# EAGLE schematic KKK_valdiklis (EAGLE 6.4)
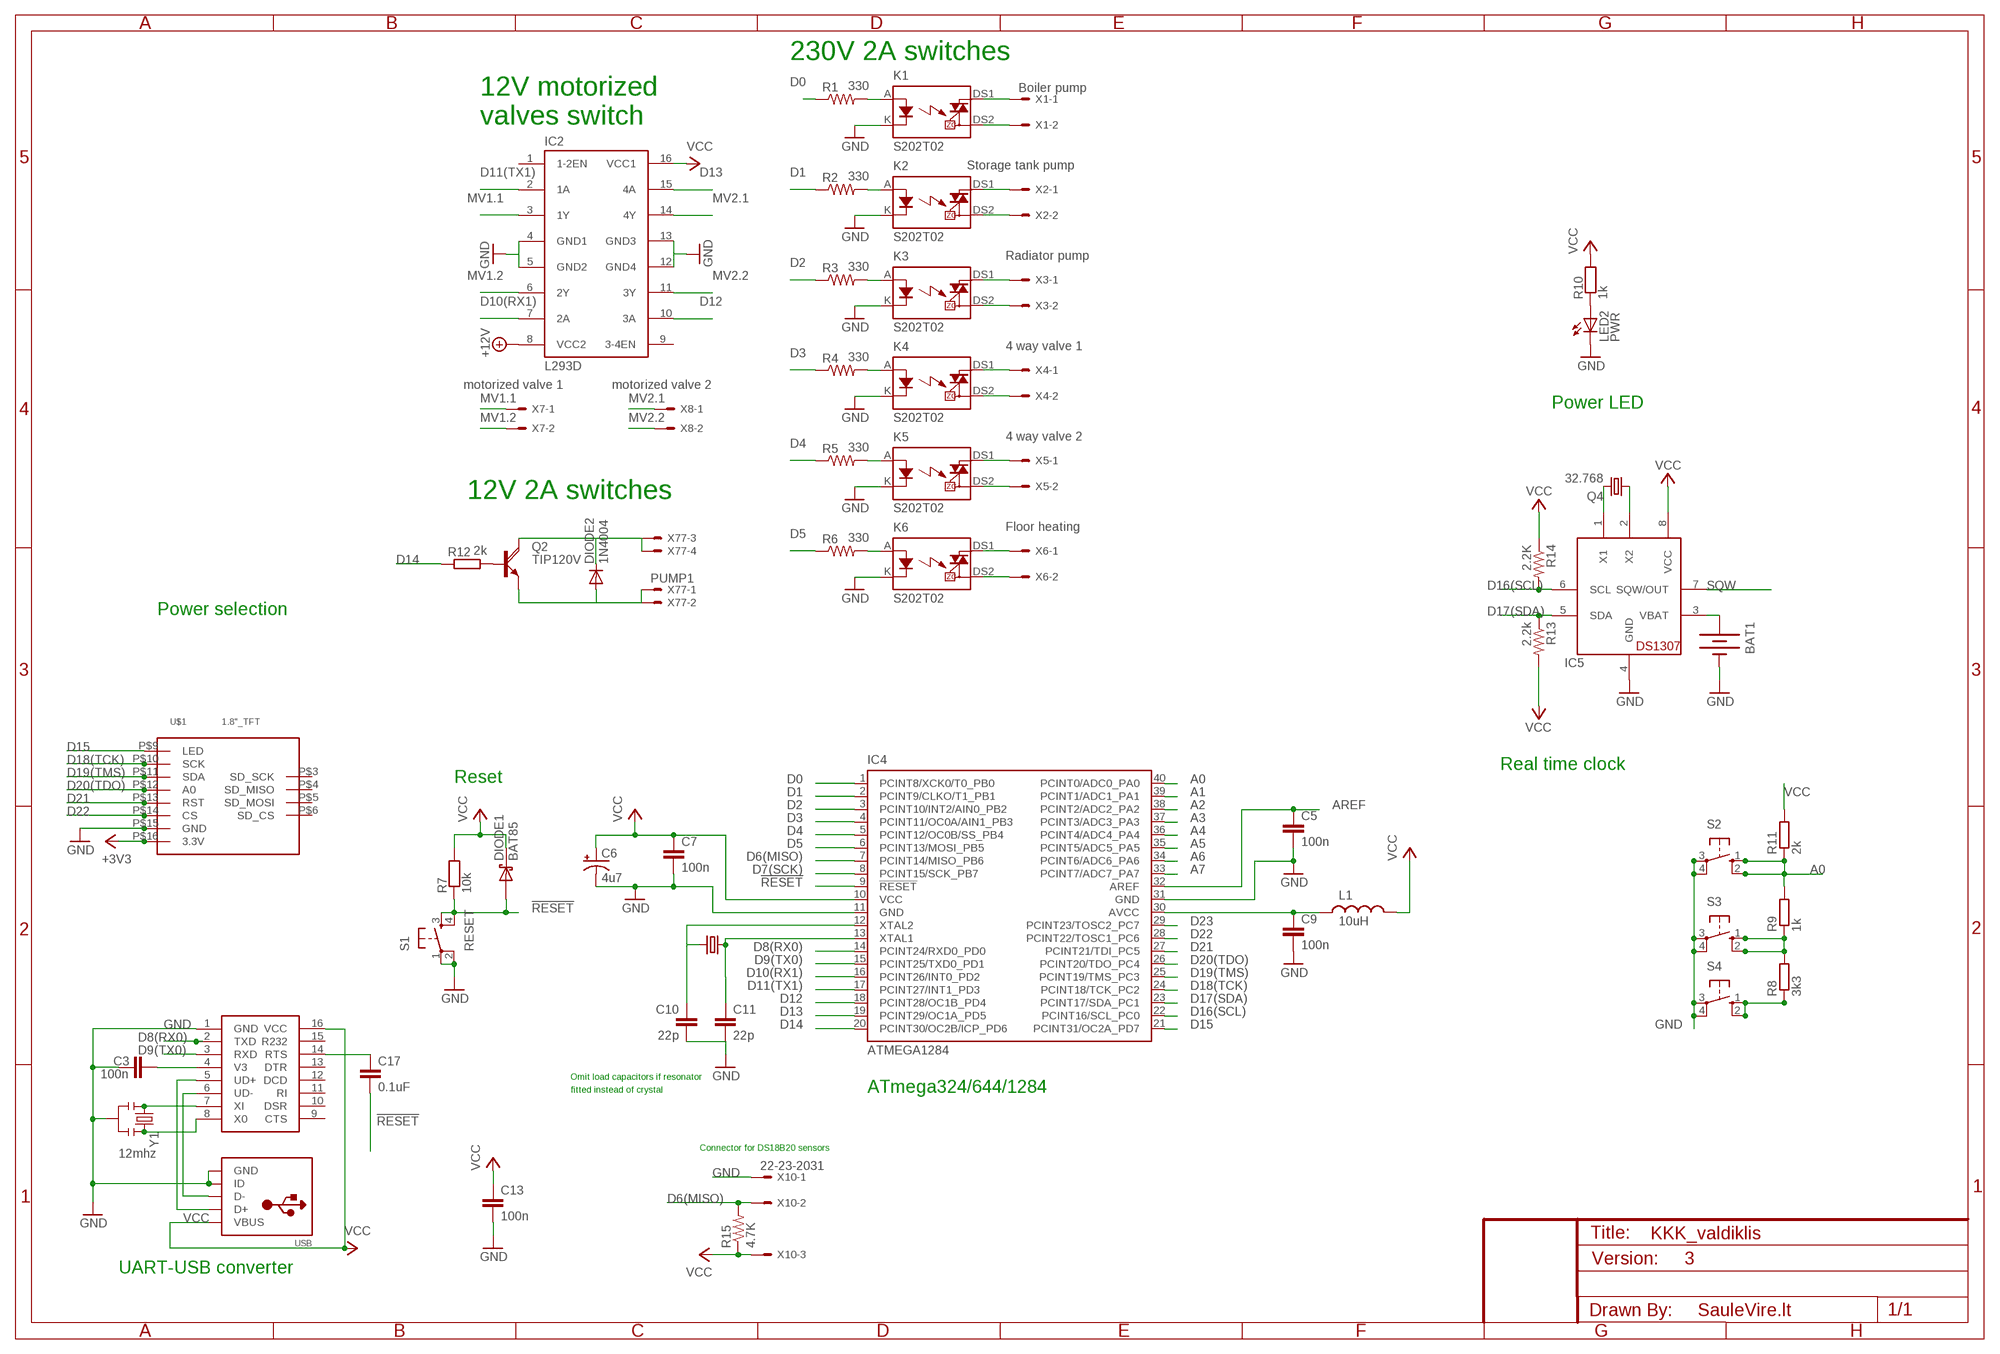
[diagram p0: schematic, sheet 1]

## Parts
BAT1  BATTERY20PTH  [BATTCOM_20MM_PTH]
C3  100n  CAPPTH  [CAP-PTH-SMALL]
C5  100n  CAPPTH  [CAP-PTH-SMALL]
C6  4u7  CAP_POLPTH2  [CPOL-RADIAL-10UF-25V]
C7  100n  CAPPTH  [CAP-PTH-SMALL]
C9  100n  CAPPTH  [CAP-PTH-SMALL]
C10  22p  CAPPTH  [CAP-PTH-SMALL]
C11  22p  CAPPTH  [CAP-PTH-SMALL]
C13  100n  CAPPTH  [CAP-PTH-SMALL]
C17  0.1uF  C-EU025-024X044  [C025-024X044]
DIODE1  BAT85  DIODE-SCHOTTKY  [DIODE-TH-0.4]
DIODE2  1N4004  [DO41-10]
IC2  L293D  [DIL16]
IC4  ATMEGA1284  ATMEGA644-20PU  [DIL40]
IC5  DS1307  [DIL08]
K1  S202T02  [S202T02]
K2  S202T02  [S202T02]
K3  S202T02  [S202T02]
K4  S202T02  [S202T02]
K5  S202T02  [S202T02]
K6  S202T02  [S202T02]
L1  10uH  INDUCTOR0.4"-AXIAL  [RES-AXIAL-0.4]
LED2  PWR  LED3MM  [LED3MM]
Q2  TIP120V  [TO220AV]
Q4  32.768  CRYTALTC38H  [TC38H]
R1  330  R-US_0207/10  [0207/10]
R2  330  R-US_0207/10  [0207/10]
R3  330  R-US_0207/10  [0207/10]
R4  330  R-US_0207/10  [0207/10]
R5  330  R-US_0207/10  [0207/10]
R6  330  R-US_0207/10  [0207/10]
R7  10k  RESISTOR  [RES-AXIAL-0.4]
R8  3k3  R-EU_0207/10  [0207/10]
R9  1k  R-EU_0207/10  [0207/10]
R10  1k  RESISTOR  [RES-AXIAL-0.4]
R11  2k  R-EU_0207/10  [0207/10]
R12  2k  R-EU_0207/10  [0207/10]
R13  2.2k  R-US_0207/10  [0207/10]
R14  2.2K  R-US_0207/10  [0207/10]
R15  4.7K  R-US_0207/10  [0207/10]
S1  RESET  TAC_SWITCHPTH  [TACTILE-PTH]
S2  10-XX  [B3F-10XX]
S3  10-XX  [B3F-10XX]
S4  10-XX  [B3F-10XX]
U$1  1.8"_TFT  [1.8"_TFT]
U$2  CH340G  [SO016]
USB  USBMOLEX  [USB-MINIB-THM-MOLEX]
X1  Boiler pump  22-23-2021  [22-23-2021]
X2  Storage tank pump  22-23-2021  [22-23-2021]
X3  Radiator pump  22-23-2021  [22-23-2021]
X4  4 way valve 1  22-23-2021  [22-23-2021]
X5  4 way valve 2  22-23-2021  [22-23-2021]
X6  Floor heating  22-23-2021  [22-23-2021]
X7  motorized valve 1  22-23-2021  [22-23-2021]
X8  motorized valve 2  22-23-2021  [22-23-2021]
X9  16MHz  CRYSTALHC49US  [HC49US]
X10  22-23-2031  [22-23-2031]
X77  PUMP1  22-23-2041  [22-23-2041]
Y1  12mhz  RESONATORPTH  [RESONATOR-PTH]

## Nets
!RESET: C17.2 DIODE1.A IC4.9(!RESET) R7.P$1 S1.3 S1.4
+3V3 [power]: U$1.P$16(3.3V)
+12V: IC2.8(VCC2)
A0: IC4.40(PCINT0/ADC0_PA0) R9.2 R11.1 S2.1(S) S2.2(S1)
A1: IC4.39(PCINT1/ADC1_PA1)
A2: IC4.38(PCINT2/ADC2_PA2)
A3: IC4.37(PCINT3/ADC3_PA3)
A4: IC4.36(PCINT4/ADC4_PA4)
A5: IC4.35(PCINT5/ADC5_PA5)
A6: IC4.34(PCINT6/ADC6_PA6)
A7: IC4.33(PCINT7/ADC7_PA7)
AREF: C5.1 IC4.32(AREF)
AVCC [power]: C9.1 IC4.30(AVCC) L1.P$1
D0: IC4.1(PCINT8/XCK0/T0_PB0) R1.1
D1: IC4.2(PCINT9/CLKO/T1_PB1) R2.1
D2: IC4.3(PCINT10/INT2/AIN0_PB2) R3.1
D3: IC4.4(PCINT11/OC0A/AIN1_PB3) R4.1
D4: IC4.5(PCINT12/OC0B/SS_PB4) R5.1
D5: IC4.6(PCINT13/MOSI_PB5) R6.1
D6(MISO): IC4.7(PCINT14/MISO_PB6) R15.2 X10.2
D7(SCK): IC4.8(PCINT15/SCK_PB7)
D8(RX0): IC4.14(PCINT24/RXD0_PD0) U$2.2(TXD)
D9(TX0): IC4.15(PCINT25/TXD0_PD1) U$2.3(RXD)
D10(RX1): IC2.7(2A) IC4.16(PCINT26/INT0_PD2)
D11(TX1): IC2.2(1A) IC4.17(PCINT27/INT1_PD3)
D12: IC2.10(3A) IC4.18(PCINT28/OC1B_PD4)
D13: IC2.15(4A) IC4.19(PCINT29/OC1A_PD5)
D14: IC4.20(PCINT30/OC2B/ICP_PD6) R12.1
D15: IC4.21(PCINT31/OC2A_PD7) U$1.P$9(LED)
D16(SCL): IC4.22(PCINT16/SCL_PC0) IC5.6(SCL) R14.2
D17(SDA): IC4.23(PCINT17/SDA_PC1) IC5.5(SDA) R13.1
D18(TCK): IC4.24(PCINT18/TCK_PC2) U$1.P$10(SCK)
D19(TMS): IC4.25(PCINT19/TMS_PC3) U$1.P$11(SDA)
D20(TDO): IC4.26(PCINT20/TDO_PC4) U$1.P$12(A0)
D21: IC4.27(PCINT21/TDI_PC5) U$1.P$13(RST)
D22: IC4.28(PCINT22/TOSC1_PC6) U$1.P$14(CS)
D23: IC4.29(PCINT23/TOSC2_PC7)
GND [power]: BAT1.2(-) C3.1 C5.2 C6.2(-) C7.2 C9.2 C10.2 C11.2 C13.2 DIODE2.A IC2.4(GND1) IC2.5(GND2) IC2.12(GND4) IC2.13(GND3) IC4.11(GND) IC4.31(GND) IC5.4(GND) K1.K K2.K K3.K K4.K K5.K K6.K LED2.K(C) Q2.E S1.1 S1.2 S2.3(P) S2.4(P1) S3.3(P) S3.4(P1) S4.3(P) S4.4(P1) U$1.P$15(GND) U$2.1(GND) USB.GND USB.ID X10.1 X77.1 X77.2 Y1.2
MV1.1: IC2.3(1Y) X7.1
MV1.2: IC2.6(2Y) X7.2
MV2.1: IC2.14(4Y) X8.1
MV2.2: IC2.11(3Y) X8.2
N$1: C11.1 IC4.13(XTAL1) X9.1
N$2: C10.1 IC4.12(XTAL2) X9.2
N$5: U$2.7(XI) Y1.1
N$6: R8.1 S4.1(S) S4.2(S1)
N$7: C3.2 U$2.4(V3)
N$8: LED2.A R10.P$1
N$9: U$2.8(X0) Y1.3
N$10: R8.2 R9.1 S3.1(S) S3.2(S1)
N$11: C17.1 U$2.14(RTS)
N$12: U$2.6(UD-) USB.D-
N$13: Q2.B R12.2
N$15: DIODE2.C Q2.C X77.3 X77.4
N$16: K3.A R3.2
N$18 [220v]: K3.DS1 X3.1
N$20: IC5.1(X1) Q4.2
N$21: IC5.2(X2) Q4.1
N$22: U$2.5(UD+) USB.D+
N$23 [220v]: K3.DS2 X3.2
N$24: K2.A R2.2
N$25 [220v]: K2.DS1 X2.1
N$26 [220v]: K2.DS2 X2.2
N$27: BAT1.1(+) IC5.3(VBAT)
N$28: K4.A R4.2
N$29 [220v]: K4.DS1 X4.1
N$30 [220v]: K4.DS2 X4.2
N$31: K1.A R1.2
N$32 [220v]: K1.DS1 X1.1
N$33 [220v]: K1.DS2 X1.2
N$34: K6.A R6.2
N$35 [220v]: K6.DS1 X6.1
N$36 [220v]: K6.DS2 X6.2
N$37: K5.A R5.2
N$38 [220v]: K5.DS1 X5.1
N$39 [220v]: K5.DS2 X5.2
SQW: IC5.7(SQW/OUT)
VCC [power]: C6.1(+) C7.1 C13.1 DIODE1.C IC2.16(VCC1) IC4.10(VCC) IC5.8(VCC) L1.P$2 R7.P$2 R10.P$2 R11.2 R13.2 R14.1 R15.1 U$2.16(VCC) USB.VBUS X10.3
Unconnected: IC2.1(1-2EN) IC2.9(3-4EN) U$1.P$3(SD_SCK) U$1.P$4(SD_MISO) U$1.P$5(SD_MOSI) U$1.P$6(SD_CS) U$2.9(CTS) U$2.10(DSR) U$2.11(RI) U$2.12(DCD) U$2.13(DTR) U$2.15(R232)

## Notes on the sheet
- 230V 2A switches
- 12V motorized 
  valves switch
- Power LED
- 12V 2A switches
- Power selection
- Real time clock
- Reset
- Omit load capacitors if resonator
- fitted instead of crystal | ATmega324/644/1284
- Connector for DS18B20 sensors
- 3
- UART-USB converter
- SauleVire.lt

## Library data of the parts
BAT1 = SparkFun-Electromechanical:BATTERY: Battery Holders Various common sizes : AA, AAA, 20mm coin cell and 12mm coin cell. 20MM_4LEGS, BATT-10373
C3 C5 C7 C9 C13 = SparkFun:CAP: Capacitor Standard 0603 ceramic capacitor, and 0.1" leaded capacitor.
C6 = SparkFun:CAP_POL: Capacitor Polarized These are standard SMD and PTH capacitors. Normally 10uF, 47uF, and 100uF in electrolytic and tantalum varieties. Always verify the external diameter of the through hole cap, it varies with capacity, voltage, and manufacturer. The EIA devices should be standard.
C10 C11 = SparkFun:CAP: Capacitor Standard 0603 ceramic capacitor, and 0.1" leaded capacitor.; OPTION: Do not fit for ceramic resonator
C17 = rcl:C-EU: CAPACITOR, European symbol
DIODE1 = SteveMarple:DIODE-SCHOTTKY
DIODE2 = diode:1N4004: DIODE general purpose rectifier, 1 A
IC2 = st-microelectronics:L293D: PUSH-PULL 4 CHANNEL DRIVER; MPN: L293D; OC_FARNELL: 9589619; OC_NEWARK: 56P8249
IC4 = SteveMarple:ATMEGA644-*PU: 8-bit Microcontroller with 64K Bytes In-System Programmable Flash Auto generated by make-symbol-device-package-bsdl.ulp Rev. 34 Source: http://www.atmel.com/dyn/resources/prod_documents/doc2593.pdf; MPN: ATMEGA644-20PU; OC_FARNELL: 1288340; OC_NEWARK: 23M5060
IC5 = adafruit:DS1307: DS1307 Real time clock (RTC) with battery backup ability. Talk to it via i2c
K1-K6 = relay-1:S202T02
L1 = SteveMarple:INDUCTOR: Inductors Basic Inductor/Choke - 0603 and 1206. Footprints are not proven and vary greatly between part numbers.
LED2 = SparkFun:LED: LEDs Standard schematic elements and footprints for 5mm, 3mm, 1206, and 0603 sized LEDs. 5mm - Spark Fun Electronics SKU : COM-00529 (and others)
Q2 = rocketfarm:TIP120: NPN DARLINGTON TRANSISTOR
Q4 = crystal:CRYTAL: CRYSTAL
R1-R6 = resistor-1:R-US_: RESISTOR, American symbol
R7 R10 = SteveMarple:RESISTOR: 1/4W PTH resistor
R8 R9 R11 R12 = resistor:R-EU_: RESISTOR, European symbol
R13-R15 = adafruit:R-US_: RESISTOR, American symbol
S1 = SparkFun:TAC_SWITCH: Momentary Switch Button commonly used for reset or general input. Spark Fun Electronics SKU : COM-00097
S2-S4 = switch-omron:10-XX: OMRON SWITCH; MPN: B3F-1000; OC_FARNELL: 176432; OC_NEWARK: 36M3542
U$1 = tft_1.8_1.44_oled_0.96:1.8"_TFT
U$2 = ch340:CH340G: CH340G
USB = adafruit:USB: USB Connectors USBMINIB - Surface Mount Female Mini-B USB Connector 4UConnector: 06564 By microbuilder.eu Thru-hole RA Female Mini-B USB Connector 4UConnector: 18732 By ladyada.net
X1-X8 = con-molex:22-23-2021: .100" (2.54mm) Center Header - 2 Pin; MF: MOLEX; MPN: 22-23-2021; OC_FARNELL: 1462926; OC_NEWARK: 25C3832
X9 = SparkFun:CRYSTAL: Crystals Various standard crystals. Proven footprints. Spark Fun Electronics SKU : COM-00534
X10 = con-molex:22-23-2031: .100" (2.54mm) Center Header - 3 Pin; MF: MOLEX; MPN: 22-23-2031; OC_FARNELL: 1462950; OC_NEWARK: 30C0862
X77 = con-molex:22-23-2041: .100" (2.54mm) Center Header - 4 Pin; MF: MOLEX; MPN: 22-23-2041; OC_FARNELL: 1462920; OC_NEWARK: 38C0355
Y1 = SparkFun-FreqCtrl:RESONATOR: Resonator Small SMD resonator. Used, eg, on the Arduino Pro/ Pro Mini boards. 8MHz- XTAL-08895 16MHz- XTAL-08900

## Net classes
0 default: width 0.178 mm, clearance 0.205 mm
1 power: width 0.61 mm, clearance 0.203 mm
3 antenna: width 0.61 mm
5 220v: width 1 mm